# EAGLE schematic test0 (EAGLE 8.2.2)
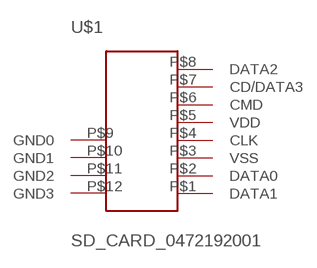
[diagram p0: schematic, sheet 1]

## Parts
U$1  SD_CARD_0472192001  [0472192001]
Unconnected: U$1.P$1(DATA1) U$1.P$2(DATA0) U$1.P$3(VSS) U$1.P$4(CLK) U$1.P$5(VDD) U$1.P$6(CMD) U$1.P$7(CD/DATA3) U$1.P$8(DATA2) U$1.P$9(GND0) U$1.P$10(GND1) U$1.P$11(GND2) U$1.P$12(GND3)

## Library data of the parts
U$1 = 0472192001_LEADFREE:SD_CARD_0472192001